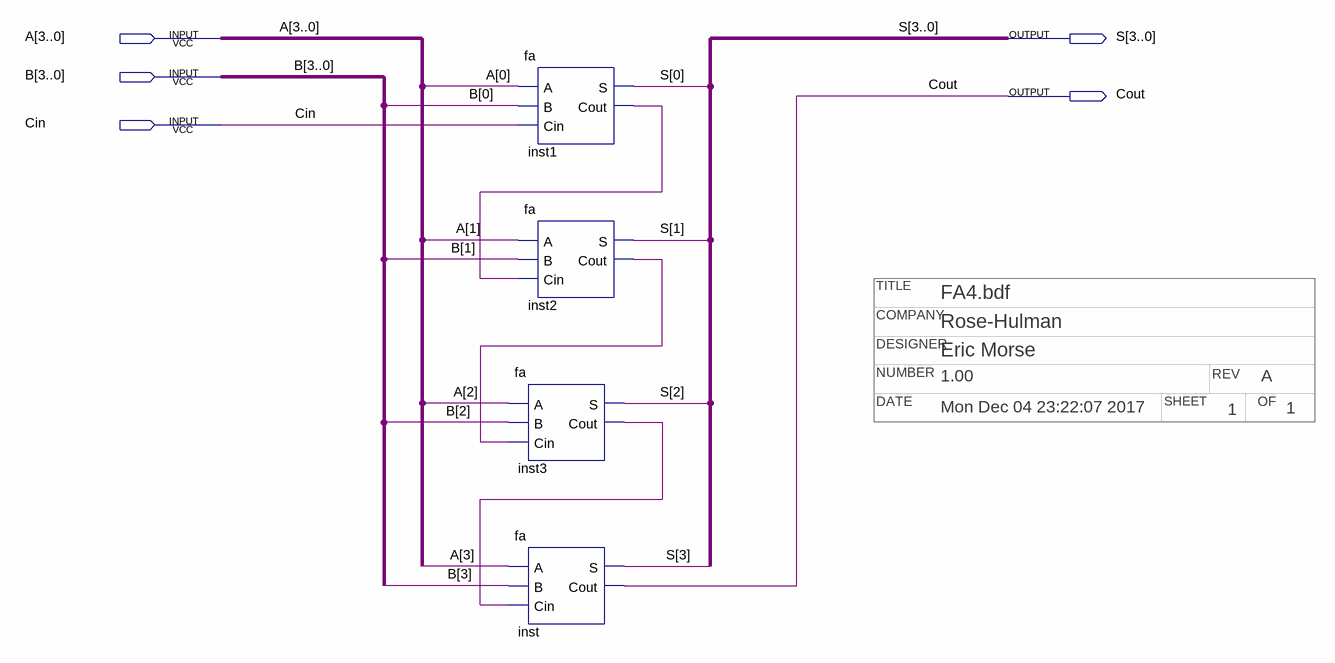
[diagram p0: schematic sheet]
// Quartus schematic fa4.bdf as structural Verilog: 4 symbols, 5 pins
// Title block: COMPANY: Rose-Hulman; DATE: Mon Dec 04 23:22:07 2017; DESIGNER: Eric Morse; NUMBER: 1.00; OF: 1; REV: A; SHEET: 1; TITLE: FA4.bdf
module fa4 (
  input  [3:0] A,
  input  [3:0] B,
  input  Cin,
  output [3:0] S,
  output Cout
);

  wire inst1_cout, inst2_cout, inst3_cout;

  fa inst3 (.A(A[2]), .B(B[2]), .Cin(inst2_cout), .S(S[2]), .Cout(inst3_cout));
  fa inst (.A(A[3]), .B(B[3]), .Cin(inst3_cout), .S(S[3]), .Cout(Cout));
  fa inst1 (.A(A[0]), .B(B[0]), .Cin(Cin), .S(S[0]), .Cout(inst1_cout));
  fa inst2 (.A(A[1]), .B(B[1]), .Cin(inst1_cout), .S(S[1]), .Cout(inst2_cout));
endmodule
